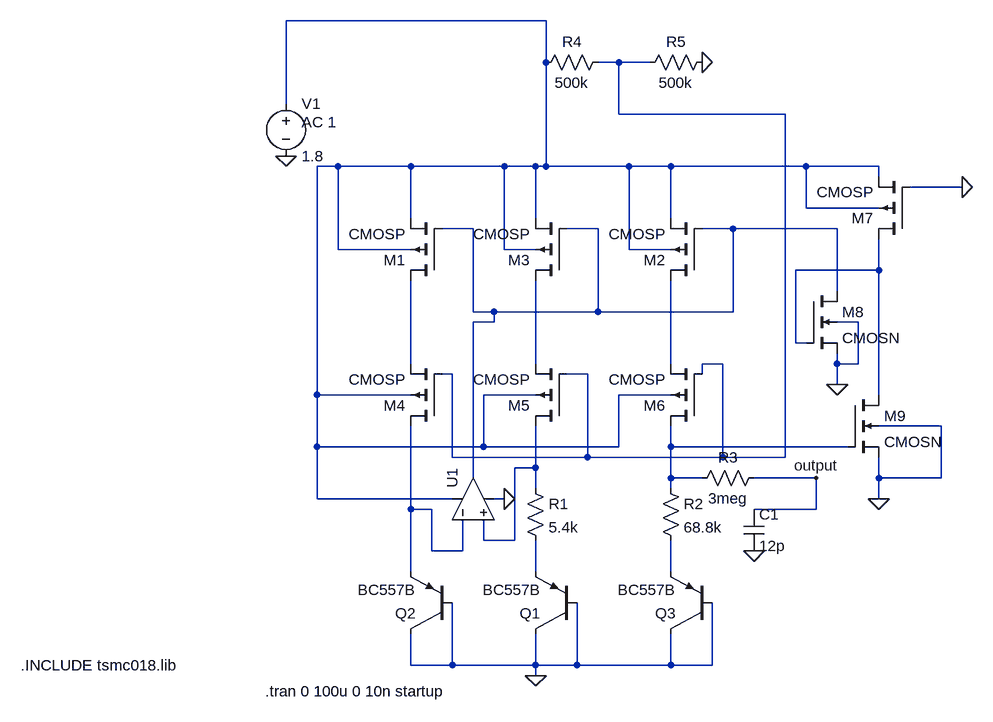
[diagram p0: schematic bgr_opamp_cascoded.asc]
bgr_opamp_cascoded.asc, the LTspice schematic file:
Version 4
SHEET 1 880 680
WIRE 80 -1008 -320 -1008
WIRE 80 -944 80 -1008
WIRE 192 -944 160 -944
WIRE 240 -944 192 -944
WIRE -320 -880 -320 -1008
WIRE 192 -864 192 -944
WIRE 448 -864 192 -864
WIRE -240 -784 -272 -784
WIRE -128 -784 -240 -784
WIRE 16 -784 -128 -784
WIRE 64 -784 16 -784
WIRE 80 -784 80 -944
WIRE 80 -784 64 -784
WIRE 208 -784 80 -784
WIRE 272 -784 208 -784
WIRE 480 -784 272 -784
WIRE 592 -784 480 -784
WIRE 592 -768 592 -784
WIRE 720 -752 640 -752
WIRE 480 -720 480 -784
WIRE 592 -720 480 -720
WIRE -128 -704 -128 -784
WIRE 64 -704 64 -784
WIRE 272 -704 272 -784
WIRE -32 -688 -80 -688
WIRE 160 -688 112 -688
WIRE 368 -688 320 -688
WIRE 528 -688 368 -688
WIRE -240 -656 -240 -784
WIRE -128 -656 -240 -656
WIRE 16 -656 16 -784
WIRE 64 -656 16 -656
WIRE 208 -656 208 -784
WIRE 272 -656 208 -656
WIRE 592 -624 592 -672
WIRE 592 -624 464 -624
WIRE 528 -592 528 -688
WIRE -32 -560 -32 -688
WIRE 0 -560 -32 -560
WIRE 160 -560 160 -688
WIRE 160 -560 0 -560
WIRE 368 -560 368 -688
WIRE 368 -560 160 -560
WIRE 0 -544 0 -560
WIRE 0 -544 -32 -544
WIRE 560 -544 528 -544
WIRE 464 -512 464 -624
WIRE 480 -512 464 -512
WIRE -128 -480 -128 -608
WIRE 64 -480 64 -608
WIRE 272 -480 272 -608
WIRE 352 -480 320 -480
WIRE 528 -480 528 -496
WIRE 560 -480 560 -544
WIRE 560 -480 528 -480
WIRE -64 -464 -80 -464
WIRE 144 -464 112 -464
WIRE 320 -464 320 -480
WIRE 528 -448 528 -480
WIRE -272 -432 -272 -784
WIRE -128 -432 -272 -432
WIRE 64 -432 -16 -432
WIRE 272 -432 192 -432
WIRE 592 -432 592 -624
WIRE 688 -384 592 -384
WIRE -272 -352 -272 -432
WIRE -16 -352 -16 -432
WIRE -16 -352 -272 -352
WIRE 192 -352 192 -432
WIRE 192 -352 -16 -352
WIRE 272 -352 272 -384
WIRE 544 -352 272 -352
WIRE -64 -336 -64 -464
WIRE 144 -336 144 -464
WIRE 144 -336 -64 -336
WIRE 352 -336 352 -480
WIRE 352 -336 144 -336
WIRE 448 -336 448 -864
WIRE 448 -336 352 -336
WIRE 64 -320 64 -384
WIRE 64 -320 32 -320
WIRE -32 -304 -32 -544
WIRE 272 -304 272 -352
WIRE 320 -304 272 -304
WIRE 496 -304 400 -304
WIRE 592 -304 592 -336
WIRE 688 -304 688 -384
WIRE 688 -304 592 -304
WIRE 64 -288 64 -320
WIRE 272 -288 272 -304
WIRE -272 -272 -272 -352
WIRE -64 -272 -272 -272
WIRE 16 -272 0 -272
WIRE 592 -272 592 -304
WIRE -128 -256 -128 -384
WIRE -96 -256 -128 -256
WIRE 496 -256 496 -304
WIRE 496 -256 400 -256
WIRE -16 -208 -16 -240
WIRE 32 -208 32 -320
WIRE 32 -208 -16 -208
WIRE -96 -192 -96 -256
WIRE -48 -192 -48 -240
WIRE -48 -192 -96 -192
WIRE -128 -160 -128 -256
WIRE 64 -160 64 -208
WIRE 272 -160 272 -208
WIRE -128 -16 -128 -64
WIRE -64 -16 -64 -112
WIRE -64 -16 -128 -16
WIRE 64 -16 64 -64
WIRE 64 -16 -64 -16
WIRE 128 -16 128 -112
WIRE 128 -16 64 -16
WIRE 272 -16 272 -64
WIRE 272 -16 128 -16
WIRE 336 -16 336 -112
WIRE 336 -16 272 -16
WIRE 64 0 64 -16
FLAG 64 0 0
FLAG -320 -800 0
FLAG 16 -272 0
FLAG 320 -944 0
FLAG 400 -192 0
FLAG 496 -304 output
FLAG 720 -752 0
FLAG 592 -272 0
FLAG 528 -448 0
SYMBOL cmosp -80 -608 R180
SYMATTR InstName M1
SYMATTR Value2 l=1u w=10u
SYMBOL cmosp 320 -608 R180
SYMATTR InstName M2
SYMATTR Value2 l=1u w=10u
SYMBOL cmosp 112 -608 R180
SYMATTR InstName M3
SYMATTR Value2 l=1u w=10u
SYMBOL res 48 -304 R0
SYMATTR InstName R1
SYMATTR Value 5.4k
SYMBOL res 256 -304 R0
SYMATTR InstName R2
SYMATTR Value 68.8k
SYMBOL pnp 128 -64 R180
SYMATTR InstName Q1
SYMATTR Value BC557B
SYMATTR SpiceLine m=8
SYMBOL pnp -64 -64 R180
SYMATTR InstName Q2
SYMATTR Value BC557B
SYMBOL pnp 336 -64 R180
SYMATTR InstName Q3
SYMATTR Value BC557B
SYMBOL voltage -320 -896 R0
WINDOW 123 24 44 Left 2
WINDOW 39 0 0 Left 2
SYMATTR Value2 AC 1
SYMATTR InstName V1
SYMATTR Value 1.8
SYMBOL Opamps\\UniversalOpamp2 -32 -272 R270
SYMATTR InstName U1
SYMBOL cmosp -80 -384 R180
SYMATTR InstName M4
SYMATTR Value2 l=1u w=10u
SYMBOL cmosp 112 -384 R180
SYMATTR InstName M5
SYMATTR Value2 l=1u w=10u
SYMBOL cmosp 320 -384 R180
SYMATTR InstName M6
SYMATTR Value2 l=1u w=10u
SYMBOL res 64 -928 R270
WINDOW 0 32 56 VTop 2
WINDOW 3 0 56 VBottom 2
SYMATTR InstName R4
SYMATTR Value 500k
SYMBOL res 224 -928 R270
WINDOW 0 32 56 VTop 2
WINDOW 3 0 56 VBottom 2
SYMATTR InstName R5
SYMATTR Value 500k
SYMBOL res 304 -288 R270
WINDOW 0 32 56 VTop 2
WINDOW 3 0 56 VBottom 2
SYMATTR InstName R3
SYMATTR Value 3meg
SYMBOL cap 384 -256 R0
SYMATTR InstName C1
SYMATTR Value 12p
SYMBOL cmosp 640 -672 R180
SYMATTR InstName M7
SYMATTR Value2 l=1u w=10u
SYMBOL cmosn 480 -592 R0
SYMATTR InstName M8
SYMATTR Value2 l=1u w=5u
SYMBOL cmosn 544 -432 R0
SYMATTR InstName M9
SYMATTR Value2 l=1u w=5u
TEXT -728 -16 Left 2 !.INCLUDE tsmc018.lib
TEXT -352 24 Left 2 !.tran 0 100u 0 10n startup

The netlist it stands for:
* bgr_opamp_cascoded.asc
M1 N005 N003 N001 N001 CMOSP l=1u w=10u
M2 N007 N003 N001 N001 CMOSP l=1u w=10u
M3 N006 N003 N001 N001 CMOSP l=1u w=10u
R1 N009 N011 5.4k
R2 N008 N012 68.8k
Q1 0 0 N011 0 BC557B m=8
Q2 0 0 N010 0 BC557B
Q3 0 0 N012 0 BC557B
V1 N001 0 1.8 AC 1
XU1 N009 N010 N001 0 N003 level.2 Avol=1Meg GBW=10Meg Slew=10Meg ilimit=25m rail=0 Vos=0 phimargin=45 en=0 enk=0 in=0 ink=0 Rin=500Meg  ; pins IN+ IN- V+ V- OUT
M4 N010 N002 N005 N001 CMOSP l=1u w=10u
M5 N009 N002 N006 N001 CMOSP l=1u w=10u
M6 N008 N002 N007 N001 CMOSP l=1u w=10u
R4 N001 N002 500k
R5 N002 0 500k
R3 N008 output 3meg
C1 output 0 12p
M7 N004 0 N001 N001 CMOSP l=1u w=10u
M8 N003 N004 0 0 CMOSN l=1u w=5u
M9 N004 N008 0 0 CMOSN l=1u w=5u
.model NPN NPN
.model PNP PNP
.lib standard.bjt
.model NMOS NMOS
.model PMOS PMOS
.lib standard.mos
.INCLUDE tsmc018.lib
.tran 0 100u 0 10n startup
.lib UniversalOpamps2.sub
.backanno
.end